# Altium project 2019000808-SPI.PRJPCB
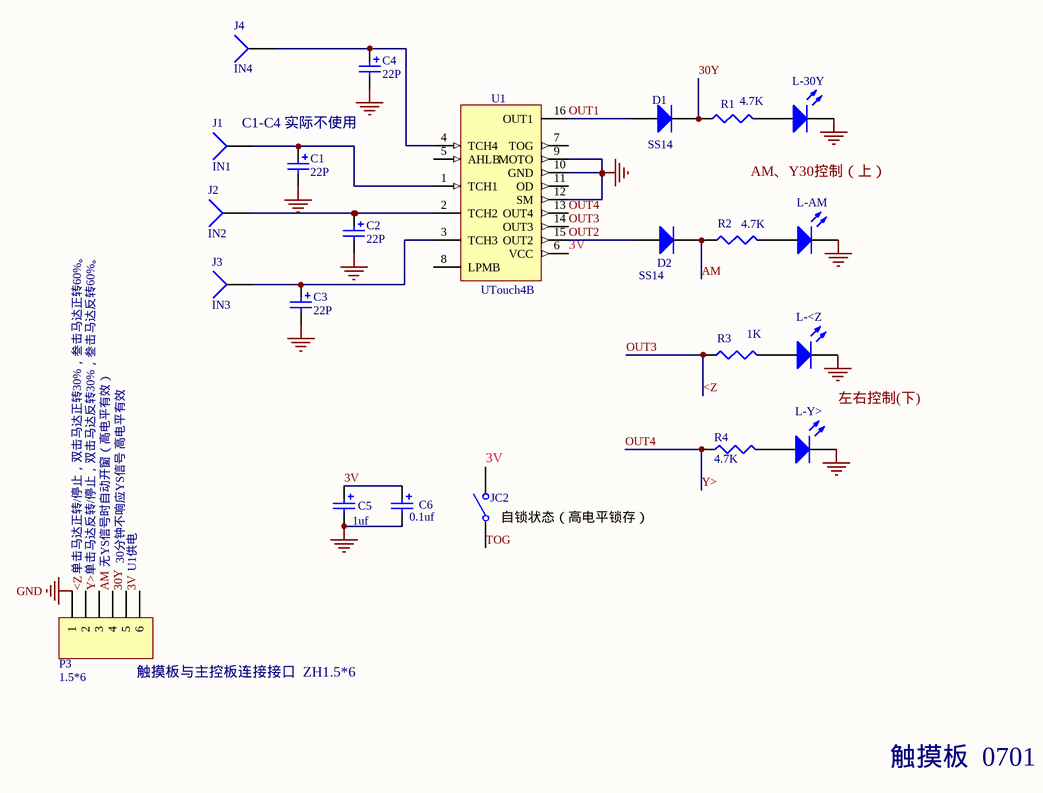
[diagram p0: SPI-4B触摸.SCHDOC]
6 sheets, 226 parts. Net scope: global (net labels, ports and power ports of the same name join across sheets).
Board files: SPI-4B触摸.PCBDOC, SPI-遥控.PCBDOC, SPI-主板-开关.PcbDoc, SPI-光电.PCBDOC, SPI-无线无线充.PcbDoc, SPI-无WIFF3P6I.PCBDOC
Sheets:
  SPI-4B触摸.SCHDOC
  SPI-遥控.SCHDOC
  SPI-主板-开关.SCHDOC
  SPI-光电.SCHDOC
  SPI-无线无线充.SCHDOC
  SPI-无WIFF3P6.SCHDOC

## Sheet SPI-4B触摸.SCHDOC
size A4; PageSetup: Record=PageOptions|CenterHorizontal=True|CenterVertical=True|PrintScale=0.96|XCorrection=1.00|YCorrection=1.00|PrintKind=2|BorderSize=5000000|LeftOffset=0|BottomOffset=0|Orientation=2|PaperLength=1000|PaperWidth=1000|Scale=100|PaperSource=7|PrintQuality=-4|MediaType=1|DitherType=10|PaperKind=A4|PrintScaleMode=1

### Parts
(Parts that share a designator on the sheet are numbered #1, #2 ... from top to bottom, then left to right.)
C1#1  value 22P  [CC2012-0805]
C2#1  value 22P  [CC2012-0805]
C3#1  value 22P  [CC2012-0805]
C4#1  value 22P  [CC2012-0805]
C5#1  1uf  [CC2012-0805]
C6#1  0.1uf  [CC2012-0805]
D1#1  SS14  [DIO7.1-3.9x1.9]
D2  SS14  [DIO7.1-3.9x1.9]
J1  IN1  [PIN1]
J2  IN2  [PIN1]
J3  IN3  [PIN1]
J4  IN4  [PIN1]
JC2  自锁状态（高电平锁存）  [SPST-2]
L-30Y  (no value)  [SMD _LED]
L-<Z  (no value)  [SMD _LED]
L-AM  (no value)  [SMD _LED]
L-Y>  (no value)  [SMD _LED]
P3  1.5*6  [MHDR1X6]
R1#1  4.7K  [C1608-0603]
R2#1  4.7K  [C1608-0603]
R3#1  value 1K  [C1608-0603]
R4#1  4.7K  [C1608-0603]
U1#1  UTouch4B  [TSSO5x6-G16]

### Nets
GND: C1#1.2 C2#1.2 C3#1.2 C4#1.2 C5#1.2 C6#1.2 L-30Y.2(K) L-<Z.2(K) L-AM.2(K) L-Y>.2(K) P3.1 U1#1.9(MOTO) U1#1.10(GND) U1#1.12(SM)
3V: C5#1.1 C6#1.1 JC2.2(NO) P3.6 U1#1.6(VCC)
30Y: D1#1.2(K) P3.5 R1#1.1
<Z: P3.2 R3#1.1 U1#1.14(OUT3)  [also labelled OUT3]
AM: D2.2(K) P3.4 R2#1.1
OUT1: D1#1.1(A) U1#1.16(OUT1)
OUT2: D2.1(A) U1#1.15(OUT2)
OUT4: P3.3 R4#1.1 U1#1.13(OUT4)  [also labelled Y>]
TOG: JC2.2(COMMON)
NetC1#1_1: C1#1.1 J1.1 U1#1.1(TCH1)
NetC2#1_1: C2#1.1 J2.1 U1#1.2(TCH2)
NetC3#1_1: C3#1.1 J3.1 U1#1.3(TCH3)
NetC4#1_1: C4#1.1 J4.1 U1#1.4(TCH4)
NetL-30Y_1: L-30Y.1(A) R1#1.2
NetL-<Z_1: L-<Z.1(A) R3#1.2
NetL-AM_1: L-AM.1(A) R2#1.2
NetL-Y>_1: L-Y>.1(A) R4#1.2

Not connected (* = marked no-connect by the designer): U1#1 5(AHLB) 7(TOG) 8(LPMB) 11(OD)

### Notes on the sheet
- C1-C4 实际不使用
- (near P3) 无YS信号时自动开窗（高电平有效）
- 30分钟不响应YS信号 高电平有效
- (near P3) U1供电
- (near P3) 单击马达正转/停止，双击马达正转30%，叁击马达正转60%。
- (near P3) 单击马达反转/停止，双击马达反转30%，叁击马达反转60%。
- (near P3) 触摸板与主控板连接接口  ZH1.5*6
- 触摸板  0701
- Labels drawn without touching a wire or pin: AM、Y30控制（上）, 左右控制(下)

### Library data of the parts
C1#1 C2#1 C3#1 C4#1 C5#1 C6#1 = Cap Pol3: Polarized Capacitor (Surface Mount); Published: 8-Jun-2000; LatestRevisionDate: 17-Jul-2002; LatestRevisionNote: Re-released for DXP Platform.; Publisher: Altium Limited; PackageReference: C0805
D1#1 D2 = Diode 1N914: High Conductance Fast Diode; Published: 8-Jun-2000; LatestRevisionDate: 17-Jul-2002; LatestRevisionNote: Re-released for DXP Platform.; Publisher: Altium Limited; PackageReference: DO-35; DatasheetDocument: 1997; Code_JEDEC: DO-204-AH
J1-J4 = Socket: LatestRevisionDate: 17-Jul-2002; LatestRevisionNote: Re-released for DXP Platform.; Publisher: Altium Limited
JC2 = SW-SPST: Single-Pole, Single-Throw Switch; Published: 24-Mar-1999; LatestRevisionDate: 17-Jul-2002; LatestRevisionNote: Re-released for DXP Platform.; Publisher: Altium Limited
L-30Y L-<Z L-AM L-Y> = LED3: Typical BLUE SiC LED; Published: 8-Jun-2000; LatestRevisionDate: 17-Dec-2003; LatestRevisionNote: PCB Footprint replaced.; Publisher: Altium Limited
P3 = MHDR1X6: Header, 6-Pin; LatestRevisionDate: 17-Jul-2002; LatestRevisionNote: Re-released for DXP Platform.; Publisher: Altium Limited
R1#1 R2#1 R3#1 R4#1 = Res3: Resistor; Published: 8-Jun-2000; LatestRevisionDate: 17-Jul-2002; LatestRevisionNote: Re-released for DXP Platform.; Publisher: Altium Limited
U1#1 = ADC-8: Generic 8-Bit A/D Converter; Published: 8-Jun-2000; LatestRevisionDate: 17-Jul-2002; LatestRevisionNote: Re-released for DXP Platform.; Publisher: Altium Limited; Code_JEDEC: MO-153-AB

## Sheet SPI-遥控.SCHDOC
size B; SheetNumber: 0; SheetTotal: 0; PageSetup: Record=PageOptions|CenterHorizontal=True|CenterVertical=True|PrintScale=0.73|XCorrection=1.00|YCorrection=1.00|PrintKind=2|BorderSize=5000000|LeftOffset=0|BottomOffset=0|Orientation=2|PaperLength=1000|PaperWidth=1000|Scale=100|PaperSource=1|PrintQuality=300|MediaType=1|DitherType=10|PaperKind=A4|PrintScaleMode=1
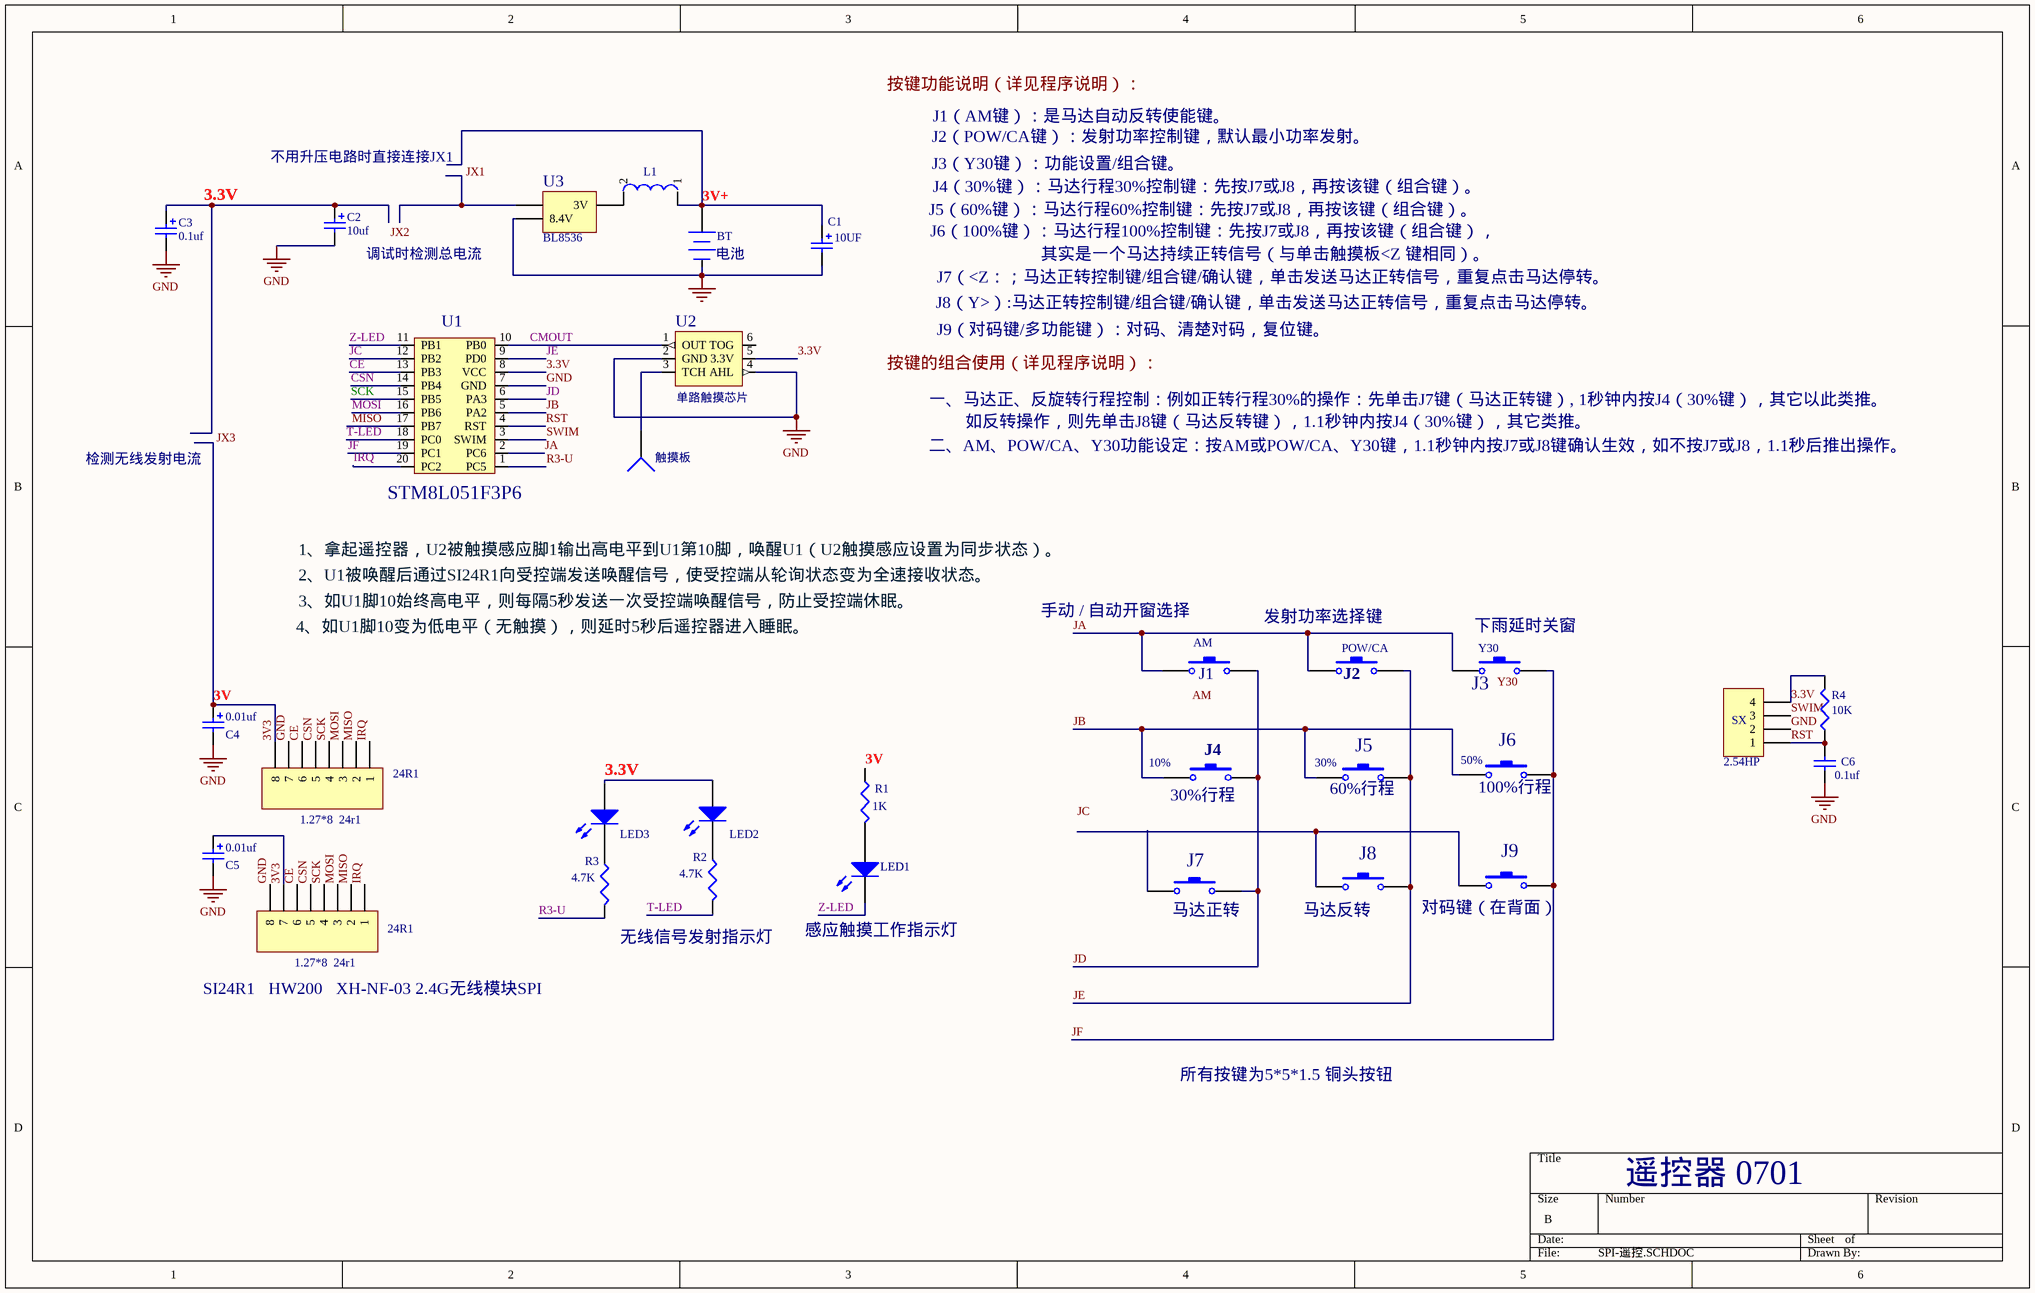
[diagram p1: SPI-遥控.SCHDOC]

### Parts
(Parts that share a designator on the sheet are numbered #1, #2 ... from top to bottom, then left to right.)
10%  J4  [SPST-2]
24R1#1  1.27*8  24r1  [HDR1X8]
24R1#2  1.27*8  24r1  [HDR1X8]
30%  J5  [SPST-2]
50%  J6  [SPST-2]
?#1  触摸板  [PIN1]
AM  J1  [SPST-2]
BT#1  3V  [BAT-2]  (value not drawn)
C1#2  10UF  [CC2012-0805]
C2#2  10uf  [CC2012-0805]
C3#2  0.1uf  [CC2012-0805]
C4#2  0.01uf  [CC2012-0805]
C5#2  0.01uf  [CC2012-0805]
C6#2  value 0.1uf  [CC1608-0603]  (hidden comment: Cap Semi)
L1#1  (no value)  [L7]
LED1  LED  [LED-1]
LED2  LED  [LED-1]  (value not drawn)
LED3  LED  [LED-1]  (value not drawn)
POW/CA  J2  [SPST-2]
R1#2  value 1K  [C1608-0603]
R2#2  value 4.7K  [C1608-0603]
R3#2  value 4.7K  [C1608-0603]
R4#2  value 10K  [C1608-0603]
SX#1  2.54HP  [HDR1X4]
U1#2  STM8L051F3P6  [TSSOP20]
U2#1  单路触摸芯片  [2308]
U3#1  BL8536  [MHDR2X2]
Y30  J3  [SPST-2]
对码键（在背面）  J9  [SPST-2]
马达反转  J8  [SPST-2]
马达正转  J7  [SPST-2]

### Nets
GND: 24R1#1.7 24R1#2.8 C1#2.2 C2#2.2 C3#2.2 C4#2.2 C5#2.2 C6#2.1 SX#1.2 U1#2.7(GND) U2#1.2(GND) U2#1.4(AHL) U3#1.3.3_IN(8.4V)
3.3V: C2#2.1 C3#2.1 LED2.1(A) LED3.1(A) R4#2.2 SX#1.4 U1#2.8(VCC) U2#1.5(3.3V)
3V: 24R1#1.6 24R1#1.8 24R1#2.6 24R1#2.7 C4#2.1 C5#2.1 R1#2.1 U1#2.13(PB3)  [also labelled 3V3, CE]
3V+: BT#1.1(+) C1#2.1 L1#1.1
CMOUT: U1#2.10(PB0) U2#1.1(OUT)
CSN: 24R1#1.5 24R1#2.5 U1#2.14(PB4)
IRQ: 24R1#1.1 24R1#2.1 U1#2.20(PC2)
JA: AM.1 POW/CA.1 U1#2.2(PC6) Y30.1
JB: 10%.1 30%.1 50%.1 U1#2.5(PA2)
JC: U1#2.12(PB2)
JD: 10%.2 AM.2 U1#2.6(PA3) 马达正转.2
JE: 30%.2 POW/CA.2 U1#2.9(PD0) 马达反转.2
JF: 50%.2 U1#2.19(PC1) Y30.2 对码键（在背面）.2
MISO: 24R1#1.2 24R1#2.2 U1#2.17(PB7)
MOSI: 24R1#1.3 24R1#2.3 U1#2.16(PB6)
R3-U: R3#2.2 U1#2.1(PC5)
RST: C6#2.2 R4#2.1 SX#1.1 U1#2.4(RST)  [project net NRSET]
SCK: 24R1#1.4 24R1#2.4 U1#2.15(PB5)
SWIM: SX#1.3 U1#2.3(SWIM)
T-LED: R2#2.2 U1#2.18(PC0)
Z-LED: LED1.2(K) U1#2.11(PB1)
Net?#1_1: ?#1.1 U2#1.3(TCH)
NetL1#1_2: L1#1.2 U3#1.2(3V)
NetLED1_1: LED1.1(A) R1#2.2
NetLED3_2: LED3.2(K) R3#2.1
Net对码键（在背面）_1: 对码键（在背面）.1 马达反转.1

Not connected (* = marked no-connect by the designer): BT#1 2(-); LED2 2(K); R2#2 1; U2#1 6(TOG); U3#1 3.3OUT; 马达正转 1

### Notes on the sheet
- 按键功能说明（详见程序说明）：
- (near C2#2) 不用升压电路时直接连接JX1
- J2（POW/CA键）：发射功率控制键，默认最小功率发射。
- J1（AM键）：是马达自动反转使能键。
- J5（60%键）：马达行程60%控制键：先按J7或J8，再按该键（组合键）。
- J6（100%键）：马达行程100%控制键：先按J7或J8，再按该键（组合键），
- J3（Y30键）：功能设置/组合键。
- J4（30%键）：马达行程30%控制键：先按J7或J8，再按该键（组合键）。
- (near C2#2) 调试时检测总电流
- (near BT#1) 电池
- J7（<Z：；马达正转控制键/组合键/确认键，单击发送马达正转信号，重复点击马达停转。
- 其实是一个马达持续正转信号（与单击触摸板<Z 键相同）。
- 按键的组合使用（详见程序说明）：
- J8（Y>）:马达正转控制键/组合键/确认键，单击发送马达正转信号，重复点击马达停转。
- J9（对码键/多功能键）：对码、清楚对码，复位键。
- 一、马达正、反旋转行程控制：例如正转行程30%的操作：先单击J7键（马达正转键）, 1秒钟内按J4（30%键），其它以此类推。
- 如反转操作，则先单击J8键（马达反转键），1.1秒钟内按J4（30%键），其它类推。
- 检测无线发射电流
- 二、AM、POW/CA、Y30功能设定：按AM或POW/CA、Y30键，1.1秒钟内按J7或J8键确认生效，如不按J7或J8，1.1秒后推出操作。
- 1、拿起遥控器，U2被触摸感应脚1输出高电平到U1第10脚，唤醒U1（U2触摸感应设置为同步状态）。
- 4、如U1脚10变为低电平（无触摸），则延时5秒后遥控器进入睡眠。
- 2、U1被唤醒后通过SI24R1向受控端发送唤醒信号，使受控端从轮询状态变为全速接收状态。
- 3、如U1脚10始终高电平，则每隔5秒发送一次受控端唤醒信号，防止受控端休眠。
- 手动 / 自动开窗选择
- 发射功率选择键
- (near Y30) 下雨延时关窗
- (near 10%) 30%行程
- (near 30%) 60%行程
- (near 50%) 100%行程
- 无线信号发射指示灯
- (near LED1) 感应触摸工作指示灯
- SI24R1   HW200   XH-NF-03 2.4G无线模块SPI
- 所有按键为5*5*1.5 铜头按钮
- 遥控器 0701
- Labels drawn without touching a wire or pin: AM, JC, JX1, JX2, JX3, Y30

### Library data of the parts
10% 30% 50% AM POW/CA Y30 对码键（在背面） 马达反转 马达正转 = SW-PB: Switch; Published: 24-Mar-1999; LatestRevisionDate: 17-Jul-2002; LatestRevisionNote: Re-released for DXP Platform.; Publisher: Altium Limited
24R1#1 24R1#2 = Header 8: Header, 8-Pin; LatestRevisionDate: 17-Jul-2002; LatestRevisionNote: Re-released for DXP Platform.; Publisher: Altium Limited
?#1 = Socket: LatestRevisionDate: 17-Jul-2002; LatestRevisionNote: Re-released for DXP Platform.; Publisher: Altium Limited
BT#1 = Battery: Multicell Battery; Published: 24-Mar-1999; LatestRevisionDate: 17-Jul-2002; LatestRevisionNote: Re-released for DXP Platform.; Publisher: Altium Limited
C1#2 C2#2 C3#2 C4#2 C5#2 = Cap Pol3: Polarized Capacitor (Surface Mount); Published: 8-Jun-2000; LatestRevisionDate: 17-Jul-2002; LatestRevisionNote: Re-released for DXP Platform.; Publisher: Altium Limited; PackageReference: C0805
C6#2 = Cap Semi: Capacitor (Semiconductor SIM Model); Published: 8-Jun-2000; LatestRevisionDate: 17-Jul-2002; LatestRevisionNote: Re-released for DXP Platform.; PackageReference: C1206; Publisher: Altium Limited
L1#1 = L
LED1-LED3 = LED1: Typical RED GaAs LED; Published: 8-Jun-2000; LatestRevisionDate: 17-Jul-2002; LatestRevisionNote: Re-released for DXP Platform.; Publisher: Altium Limited
R1#2 R2#2 R3#2 R4#2 = Res3: Resistor; Published: 8-Jun-2000; LatestRevisionDate: 17-Jul-2002; LatestRevisionNote: Re-released for DXP Platform.; Publisher: Altium Limited
SX#1 = Header 4: Header, 4-Pin; LatestRevisionDate: 17-Jul-2002; LatestRevisionNote: Re-released for DXP Platform.; Publisher: Altium Limited
U1#2 = STM8L051
U2#1 = 1308
U3#1 = MHDR2X2: Header, 2-Pin, Dual row; LatestRevisionDate: 17-Jul-2002; LatestRevisionNote: Re-released for DXP Platform.; Publisher: Altium Limited

## Sheet SPI-主板-开关.SCHDOC
size A4; PageSetup: Record=PageOptions|CenterHorizontal=True|CenterVertical=True|PrintScale=0.96|XCorrection=1.00|YCorrection=1.00|PrintKind=2|BorderSize=5000000|LeftOffset=0|BottomOffset=0|Orientation=2|PaperLength=1000|PaperWidth=1000|Scale=100|PaperSource=7|PrintQuality=-4|MediaType=1|DitherType=10|PaperKind=A4|PrintScaleMode=1
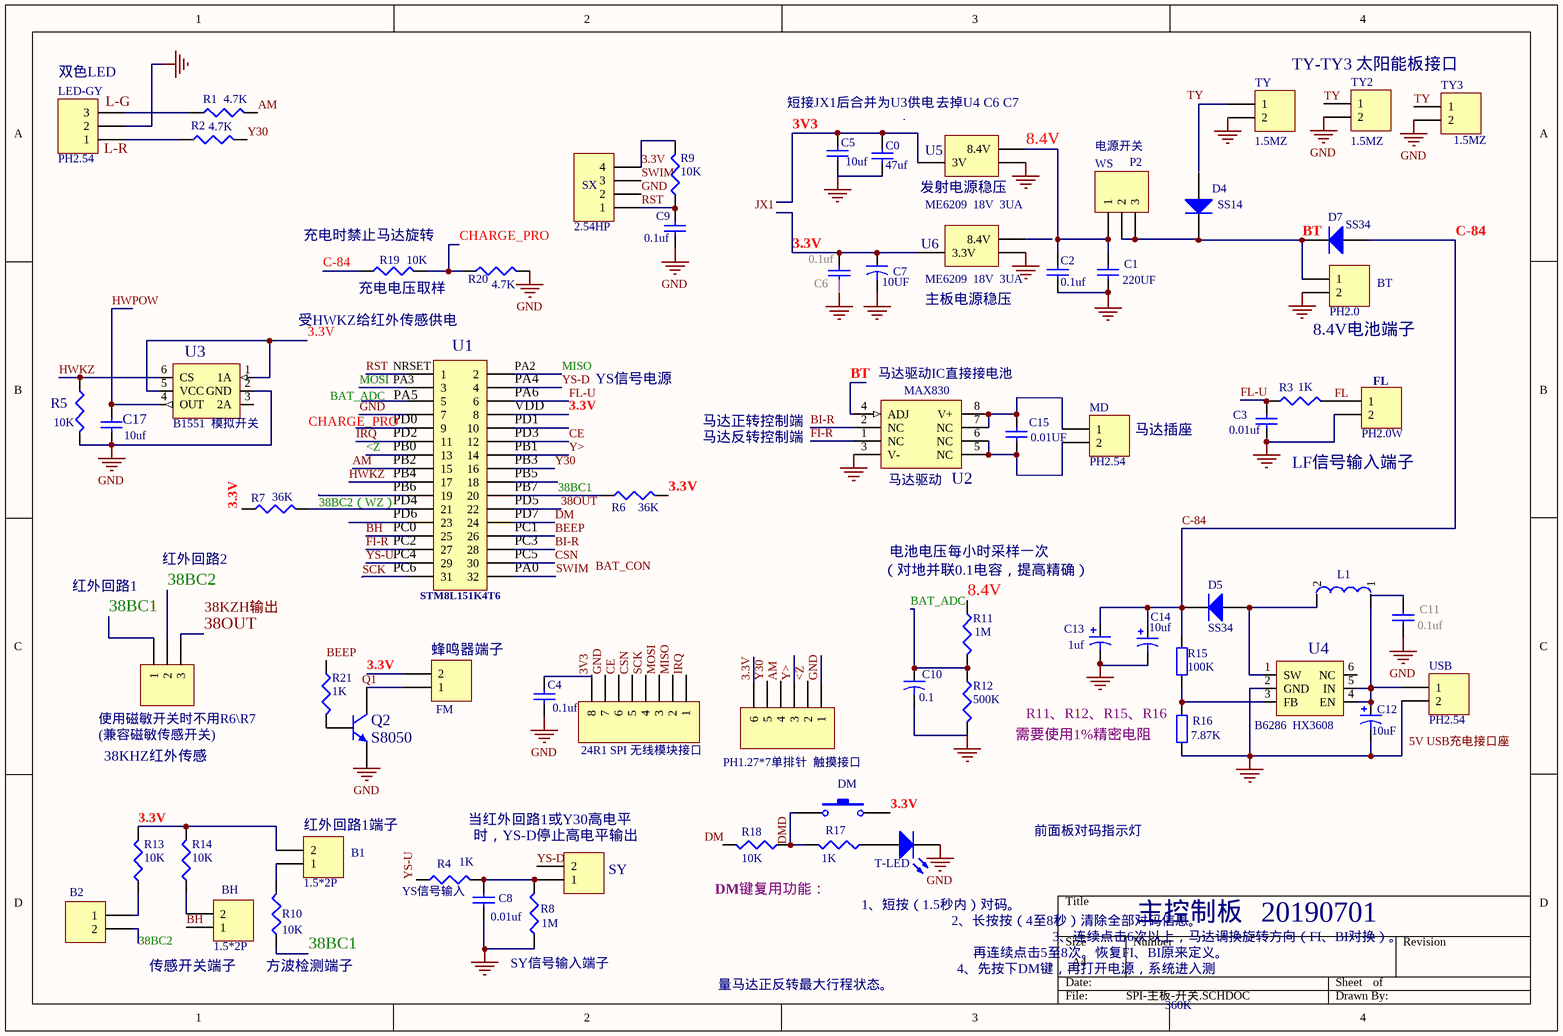
[diagram p2: SPI-主板-开关.SCHDOC]

### Parts
(Parts that share a designator on the sheet are numbered #1, #2 ... from top to bottom, then left to right.)
24R1_SPI_无线模块接口#1  Header 8  [HDR1X8]  (value not drawn)
(兼容磁敏传感开关)  PH2.0  [HDR1X3]  (value not drawn)
B1  1.5*2P  [HDR1X2]
B2  1.5*2P  [HDR1X2]  (value not drawn)
BH  1.5*2P  [HDR1X2]
BT#2  PH2.0  [HDR1X2]
C0  value 47uf  [CC1608-0603]
C1#3  value 220UF  [CC3216-1206]  (hidden comment: Cap Semi)
C2#3  value 0.1uf  [CC1608-0603]  (hidden comment: Cap Semi)
C3#3  0.01uf  [CC1608-0603]
C4#3  value 0.1uf  [CC1608-0603]
C5#3  10uf  [CC1608-0603]
C6#3  value 0.1uf  [CC1608-0603]  (hidden comment: 10UF)
C7#1  10UF  [CAPPR2-5x6.8]
C8#1  0.01uf  [CC1608-0603]
C9#1  value 0.1uf  [CC1608-0603]  (hidden comment: Cap Semi)
C10#1  value 0.1  [CAPPR2-5x6.8]  (hidden comment: 10UF)
C11#1  value 0.1uf  [CC3216-1206]  (hidden comment: Cap Semi)
C12  value 10uF  [C0805]  (hidden comment: Cap Pol1)
C13  value 1uf  [CC3216-1206]
C14  value 10uf  [CC3216-1206]
C15  0.01UF  [CC1608-0603]
C17  10uf  [CC1608-0603]
D4  SS14  [DIO7.1-3.9x1.9]
D5  SS34  [D0805]
D7  SS34  [D0805]
DM#1  (no value)  [SPST-2]
FL#1  PH2.0W  [HDR1X2]
FM  (no value)  [HDR1X2]
L1#2  (no value)  [L7]
LED-GY  PH2.54  [HDR1X3]
MD  PH2.54  [HDR1X2]
PH1.27*7单排针_触摸接口  Header 6  [HDR1X6]  (value not drawn)
Q2#1  S8050  [BCY-W3/E4]
R1#3  value 4.7K  [C1608-0603]
R2#3  value 4.7K  [C1608-0603]
R3#3  value 1K  [C1608-0603]
R4#3  value 1K  [C1608-0603]
R5#1  value 10K  [C1608-0603]
R6#1  value 36K  [C1608-0603]
R7#1  value 36K  [C1608-0603]
R8#1  value 1M  [C1608-0603]
R9#1  value 10K  [C1608-0603]
R10  value 10K  [C1608-0603]
R11#1  1M  value 360K  [C1608-0603]
R12  value 500K  [C1608-0603]
R13  value 10K  [C1608-0603]
R14  value 10K  [C1608-0603]
R15  value 100K  [C0805]  (hidden comment: Res2)
R16  value 7.87K  [C0805]  (hidden comment: Res2)
R17  value 1K  [C1608-0603]
R18  value 10K  [C1608-0603]
R19  10K  [C1608-0603]
R20  4.7K  [C1608-0603]
R21  value 1K  [C1608-0603]
SX#2  2.54HP  [HDR1X4]
SY#1  PH2.0WJ  [HDR1X2]  (value not drawn)
T-LED  (no value)  [LED-1]
TY2  1.5MZ  [HDR1X2]
TY3  1.5MZ  [HDR1X2]
TY#1  1.5MZ  [HDR1X2]
U1#3  STM8L151K4T6  [HDR2X16]
U2#2  马达驱动  Publisher: MAX830  [SO8]
U3#2  B1551  模拟开关  [2308]
U4  B6286  HX3608  [2308]
U5  ME6209  18V  3UA  [MHDR2X2]
U6  ME6209  18V  3UA  [MHDR2X2]
USB#1  PH2.54  [HDR1X2]
WS  P2  [HDR1X3]

### Nets
GND: 24R1_SPI_无线模块接口#1.7 BT#2.2 C0.1 C1#3.2 C2#3.1 C3#3.1 C4#3.1 C6#3.1 C7#1.2 C8#1.1 C9#1.1 C10#1.2 C11#1.2 C12.2 C13.2 C14.2 C17.1 FL#1.2 LED-GY.2 PH1.27*7单排针_触摸接口.1 R5#1.1 R8#1.1 R12.1 R16.2 R20.2 SX#2.2 T-LED.2(K) TY2.2 TY3.2 TY#1.2 U1#3.7 U2#2.3(V-) U3#2.2(GND) U4.2(GND) U5.3.3OUT U6.3.3OUT USB#1.2
3.3V: B1.2 C6#3.2 C7#1.1 DM#1.2 FM.2 PH1.27*7单排针_触摸接口.6 R6#1.2 R7#1.1 R9#1.2 R13.2 R14.2 SX#2.4 U1#3.8 U3#2.1(1A) U3#2.5(VCC) U6.2(3.3V)
3V3: 24R1_SPI_无线模块接口#1.6 24R1_SPI_无线模块接口#1.8 C0.2 C4#3.2 C5#3.2 U1#3.12 U5.2(3V)  [also labelled CE]  [project net 3V]
8.4V: C1#3.1 C2#3.2 R11#1.2 U5.3.3_IN(8.4V) WS.1
38BC1: (兼容磁敏传感开关).1 R6#1.1 R10.1 U1#3.20
38BC2: (兼容磁敏传感开关).2
38OUT: (兼容磁敏传感开关).3 U1#3.22  [project net 1Q-B]
<Z: PH1.27*7单排针_触摸接口.2 U1#3.13
AM: PH1.27*7单排针_触摸接口.4 R1#3.2 U1#3.15
BAT_ADC: C10#1.1 R11#1.1 R12.2
BEEP: R21.1 U1#3.26
BH: BH.1 U1#3.25
BI-R: U1#3.28 U2#2.2(NC)
BT: BT#2.1 D4.2(K) D7.2(K) U2#2.4(ADJ) WS.2 WS.3
C-84: C13.1 C14.1 D5.2(K) D7.1(A) R15.1 R19.1
CHARGE_PRO: R19.2 R20.1
CSN: 24R1_SPI_无线模块接口#1.5 U1#3.30
DM: U1#3.24
DMD: DM#1.1 R17.1 R18.2
FI-R: U1#3.27 U2#2.1(NC)
FL: FL#1.1 R3#3.2
FL-U: C3#3.2 R3#3.1 U1#3.6
HWKZ: R5#1.2 U1#3.17 U3#2.6(CS)
HWPOW: C17.2 U3#2.4(OUT)
IRQ: 24R1_SPI_无线模块接口#1.1 U1#3.11
MISO: 24R1_SPI_无线模块接口#1.2 U1#3.2  [also labelled PA2]
MOSI: 24R1_SPI_无线模块接口#1.3 U1#3.3  [also labelled PA3]
NRSET: C9#1.2 R9#1.1 SX#2.1 U1#3.1  [also labelled RST]
SCK: 24R1_SPI_无线模块接口#1.4 U1#3.31
SWIM: SX#2.3 U1#3.32
TY: TY2.1 TY3.1
Y30: PH1.27*7单排针_触摸接口.5 R2#3.2 U1#3.16
Y>: PH1.27*7单排针_触摸接口.3 U1#3.14  [project net OUT4]
YS-D: SY#1.2 U1#3.4
YS-U: R4#3.1 U1#3.29
NetB1_1: B1.1 R10.2
NetB2_1: B2.1 R13.1
NetBH_2: BH.2 R14.1
NetC8#1_2: C8#1.2 R4#3.2 R8#1.2 SY#1.1
NetC12_1: C12.1 L1#2.1 U4.4(EN) U4.5(IN) USB#1.1
NetC15_1: C15.1 MD.2 U2#2.5(NC) U2#2.6(NC)
NetC15_2: C15.2 MD.1 U2#2.7(NC) U2#2.8(V+)
NetD5_1: D5.1(A) L1#2.2 U4.1(SW)
NetFM_1: FM.1 Q2#1.3(C)
NetLED-GY_1: LED-GY.1 R2#3.1
NetLED-GY_3: LED-GY.3 R1#3.1
NetQ2#1_2: Q2#1.2(B) R21.2
NetR7#1_2: R7#1.2 U1#3.21
NetR15_2: R15.2 R16.1 U4.3(FB)
NetR17_2: R17.2 T-LED.1(A)

Not connected (* = marked no-connect by the designer): B2 2; C5#3 1; C11#1 1; D4 1(A); Q2#1 1(E); R18 1; TY#1 1; U1#3 5 9 10 18 19 23; U3#2 3(2A); U4 6(NC); U6 3.3 IN(8.4V)

### Notes on the sheet
- (near LED-GY) 双色LED
- 短接JX1后合并为U3供电
- (near U5) 去掉U4 C6 C7
- TY-TY3 太阳能板接口
- 电源开关
- (near R19) 充电时禁止马达旋转
- (near U5) 发射电源稳压
- (near R19) 充电电压取样
- 主板电源稳压
- (near U3#2) 受HWKZ给红外传感供电
- (near U1#3) PA4
- YS信号电源
- (near U2#2) 马达驱动IC直接接电池
- (near BT#2) 8.4V电池端子
- (near U1#3) PD0
- (near U1#3) PD2
- (near U1#3) PB0
- (near U1#3) PA5
- (near U1#3) PA6
- (near U1#3) PD1
- (near U1#3) PD3
- (near U1#3) PB1
- (near U1#3) VDD
- 马达正转控制端
- 马达反转控制端
- (near MD) 马达插座
- (near U1#3) PD4
- (near U1#3) PD6
- (near U1#3) PB2
- (near U1#3) PB4
- (near U1#3) PB6
- (near U1#3) PD5
- (near U1#3) PD7
- (near U1#3) PB3
- (near U1#3) PB5
- (near U1#3) PB7
- LF信号输入端子
- 红外回路2
- (near U1#3) PC0
- (near U1#3) PC2
- (near U1#3) PC4
- (near U1#3) PC6
- (near U1#3) PA0
- (near U1#3) PC1
- (near U1#3) PC3
- (near U1#3) PC5
- (near R11#1) （对地并联0.1电容，提高精确）
- (near R11#1) 电池电压每小时采样一次
- 红外回路1
- (near FM) 蜂鸣器端子
- R11、R12、R15、R16
- (near (兼容磁敏传感开关)) 使用磁敏开关时不用R6\R7
- 38KHZ红外传感
- (near R12) 需要使用1%精密电阻
- (near B1) 红外回路1端子
- 当红外回路1或Y30高电平
- 时，YS-D停止高电平输出
- 前面板对码指示灯
- (near R4#3) YS信号输入
- DM键复用功能：
- 1、短按（1.5秒内）对码。
- 主控制板
- 20190701
- (near B2) 传感开关端子
- 方波检测端子
- (near R8#1) SY信号输入端子
- 量马达正反转最大行程状态。
- 2、长按按（4至8秒）清除全部对码信息。
- 4、先按下DM键，再打开电源，系统进入测
- 再连续点击5至8次。恢复FI、BI原来定义。
- 3、连续点击6次以上，马达调换旋转方向（FI、BI对换）。
- Labels drawn without touching a wire or pin: 5V USB充电接口座, 38BC2, 38BC2（WZ）, 38KZH输出, BAT_ADC, BAT_CON, CHARGE_PRO, DM, GND, JX1, L-G, L-R, Q1, TY

### Library data of the parts
24R1_SPI_无线模块接口#1 = Header 8: Header, 8-Pin; LatestRevisionDate: 17-Jul-2002; LatestRevisionNote: Re-released for DXP Platform.; Publisher: Altium Limited
(兼容磁敏传感开关) LED-GY WS = Header 3: Header, 3-Pin; LatestRevisionDate: 17-Jul-2002; LatestRevisionNote: Re-released for DXP Platform.; Publisher: Altium Limited
B1 B2 BH BT#2 FL#1 FM MD SY#1 TY2 TY3 TY#1 USB#1 = Header 2: Header, 2-Pin; LatestRevisionDate: 17-Jul-2002; LatestRevisionNote: Re-released for DXP Platform.; Publisher: Altium Limited
C0 C1#3 C2#3 C3#3 C4#3 C5#3 C6#3 C9#1 C11#1 C15 C17 = Cap Semi: Capacitor (Semiconductor SIM Model); Published: 8-Jun-2000; LatestRevisionDate: 17-Jul-2002; LatestRevisionNote: Re-released for DXP Platform.; PackageReference: C1206; Publisher: Altium Limited
  C5#3: Value: 10uf
  C15: Value: 0.01UF
C7#1 C10#1 = Cap2: Capacitor; Published: 23-Sep-2002; Publisher: Altium Limited
  C7#1: Value: 10UF
C8#1 = Cap Semi: Capacitor (Semiconductor SIM Model); Value: 100pF; Published: 8-Jun-2000; LatestRevisionDate: 17-Jul-2002; LatestRevisionNote: Re-released for DXP Platform.; PackageReference: C1206; Publisher: Altium Limited
C12-C14 = Cap Pol1: Polarized Capacitor (Radial); Published: 8-Jun-2000; LatestRevisionDate: 17-Jul-2002; LatestRevisionNote: Re-released for DXP Platform.; PackageReference: RB7.6-15; Publisher: Altium Limited; PackageDescription: Polarized Capacitor (Radial); 2 Leads
D4 = Diode 1N914: High Conductance Fast Diode; Published: 8-Jun-2000; LatestRevisionDate: 17-Jul-2002; LatestRevisionNote: Re-released for DXP Platform.; Publisher: Altium Limited; PackageReference: DO-35; DatasheetDocument: 1997; Code_JEDEC: DO-204-AH
D5 D7 = Diode: Default Diode; Published: 8-Jun-2000; LatestRevisionDate: 17-Jul-2002; LatestRevisionNote: Re-released for DXP Platform.; PackageVersion: Sep-1996; PackageReference: SMC; Publisher: SS24; PackageDescription: DO-214-AB/SMC; 2 C-Bend Leads; Body 7.9 x 5.9 mm, inc. leads (LxW); Code_JEDEC: DO-214-AB
DM#1 = SW-PB: Switch; Published: 24-Mar-1999; LatestRevisionDate: 17-Jul-2002; LatestRevisionNote: Re-released for DXP Platform.; Publisher: Altium Limited
L1#2 = L
PH1.27*7单排针_触摸接口 = Header 6: Header, 6-Pin; LatestRevisionDate: 17-Jul-2002; LatestRevisionNote: Re-released for DXP Platform.; Publisher: Altium Limited
Q2#1 = 2N3904: NPN General Purpose Amplifier; Published: 8-Jun-2000; LatestRevisionDate: 15-Jan-2003; LatestRevisionNote: PCB Footprint 'BCY-W3/D4.7' replaced; DatasheetDocument: 1997; PackageReference: TO-92A; Publisher: Altium Limited; Code_JEDEC: TO-92A
R1#3 R2#3 R3#3 R4#3 R5#1 R6#1 R7#1 R8#1 R9#1 R10 R11#1 R12-R14 R17-R21 = Res3: Resistor; Published: 8-Jun-2000; LatestRevisionDate: 17-Jul-2002; LatestRevisionNote: Re-released for DXP Platform.; Publisher: Altium Limited
R15 R16 = Res2: Resistor; Published: 8-Jun-2000; LatestRevisionDate: 17-Jul-2002; LatestRevisionNote: Re-released for DXP Platform.; PackageReference: AXIAL-0.4; Publisher: Altium Limited; PackageDescription: Axial Device, Thru-Hole; 2 Leads; 0.4 in Pin Spacing
SX#2 = Header 4: Header, 4-Pin; LatestRevisionDate: 17-Jul-2002; LatestRevisionNote: Re-released for DXP Platform.; Publisher: Altium Limited
T-LED = LED1: Typical RED GaAs LED; Published: 8-Jun-2000; LatestRevisionDate: 17-Jul-2002; LatestRevisionNote: Re-released for DXP Platform.; Publisher: Altium Limited
U1#3 = Header 16X2: Header, 16-Pin, Dual row; LatestRevisionDate: 17-Jul-2002; LatestRevisionNote: Re-released for DXP Platform.; Publisher: Altium Limited
U2#2 = LM135D: Precision Temperature Sensor; Published: 24-Aug-2001; LatestRevisionDate: 17-Jul-2002; LatestRevisionNote: Re-released for DXP Platform.; DatasheetDocument: Oct-1997; PackageDocument: Jul-1998; PackageReference: SO8; Code_JEDEC: MS-012-AA; Code_IPC: SO8
U3#2 = 1308
U4 = 1308: 1308A: u4
U5 U6 = MHDR2X2: Header, 2-Pin, Dual row; LatestRevisionDate: 17-Jul-2002; LatestRevisionNote: Re-released for DXP Platform.; Publisher: Altium Limited

## Sheet SPI-光电.SCHDOC
size A4
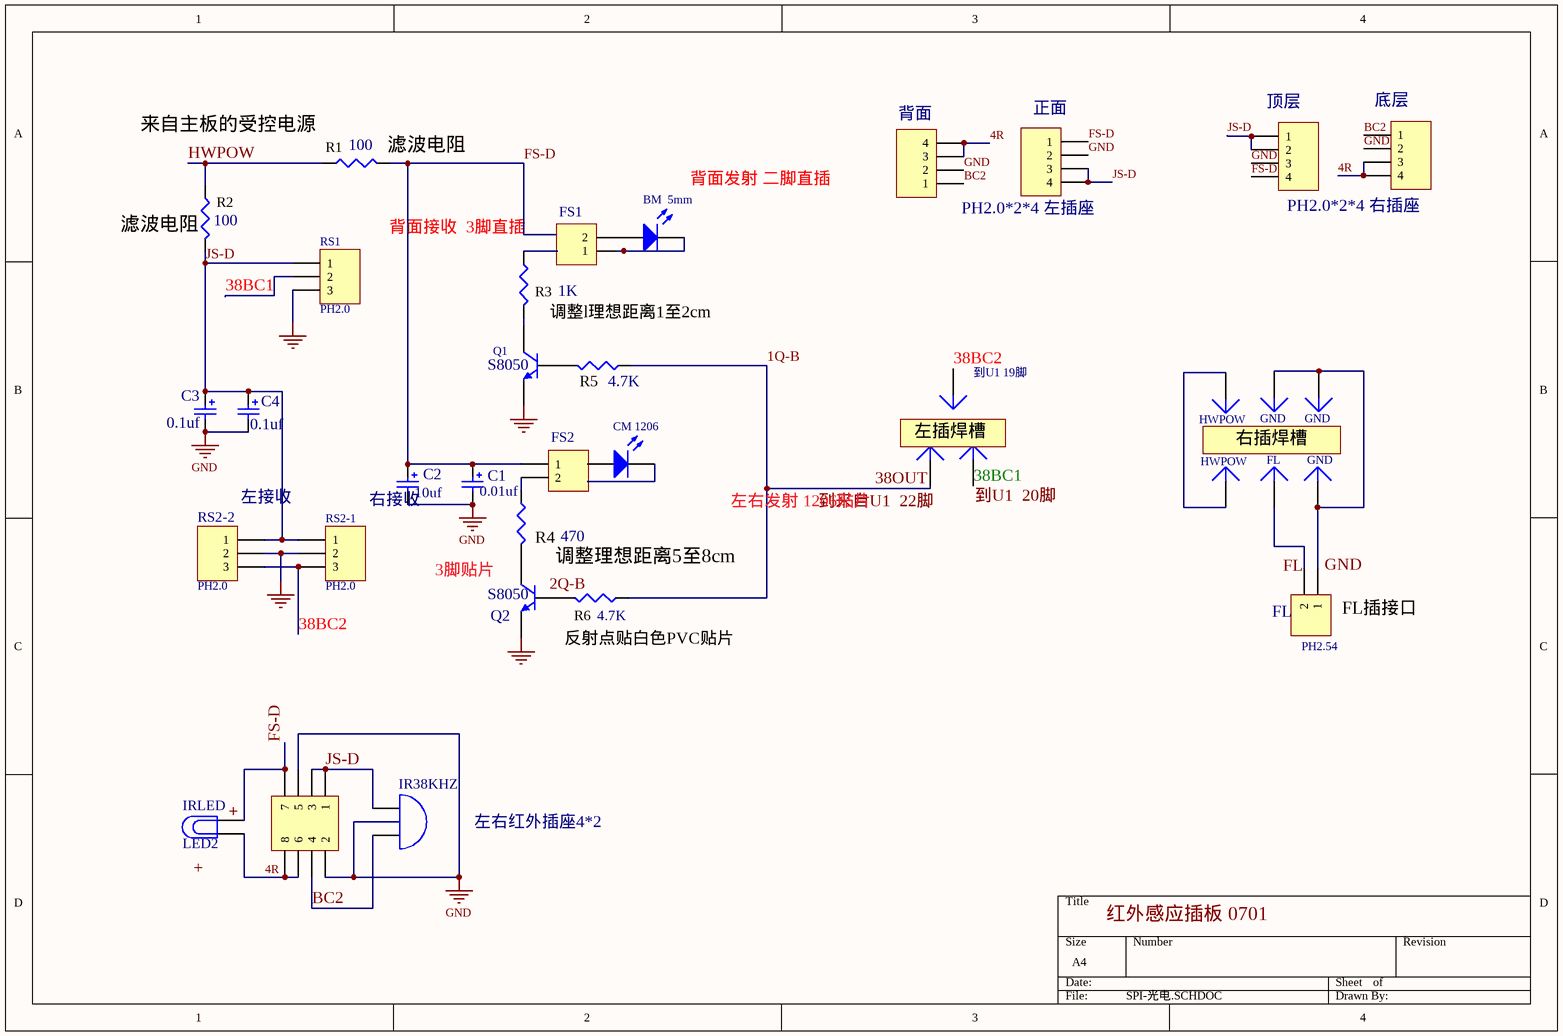
[diagram p3: SPI-光电.SCHDOC]

### Parts
(Parts that share a designator on the sheet are numbered #1, #2 ... from top to bottom, then left to right.)
38BC1  (no value)  [PIN1]
38OUT  (no value)  [PIN1]
?#2  GND  [PIN1]
BM_5mm  (no value)  [LED-1]
C1#4  0.01uf  [CC2012-0805]
C2#4  value 10uf  [CC2012-0805]
C3#4  value 0.1uf  [CC2012-0805]
C4#4  value 0.1uf  [CC2012-0805]
CM_1206  (no value)  [LED-1]
FL#2  (no value)  [PIN1]
FL#3  PH2.54  [HDR1X2]
FS1  PH2.0  [HDR1X2]  (value not drawn)
FS2  PH2.0  [HDR1X2]  (value not drawn)
GND#1  (no value)  [PIN1]
GND#2  (no value)  [PIN1]
HWPOW#1  (no value)  [PIN1]
HWPOW#2  (no value)  [PIN1]
IR38KHZ  (no value)  [PIN2]
IRLED  LED2  [PIN2]
Q1  S8050  [BCY-W3/E4]
Q2#2  S8050  [BCY-W3/E4]
R1#4  100  [C1608-0603]
R2#4  100  [C1608-0603]
R3#4  1K  [C1608-0603]
R4#4  value 470  [C1608-0603]
R5#2  value 4.7K  [C1608-0603]
R6#2  value 4.7K  [C1608-0603]
RS1  PH2.0  [HDR1X3]
RS2-1  PH2.0  [HDR1X3]
RS2-2  PH2.0  [HDR1X3]
到U1_19脚  (no value)  [PIN1]
左右红外插座4*2  PH2.0*2*4  [HDR2X4H]  (value not drawn)
底层  PH2.0*2*4  [HDR1X4]  (value not drawn)
正面  PH2.0*2*4 左插座  [HDR1X4]
背面  PH2.0*2*4  [HDR1X4]  (value not drawn)
顶层  PH2.0*2*4 右插座  [HDR1X4]

### Nets
GND: C1#4.2 C2#4.2 C3#4.2 C4#4.2 Q1.1(E) Q2#2.1(E) RS1.3 RS2-1.2 RS2-2.2 左右红外插座4*2.2 左右红外插座4*2.5 底层.2 正面.2 背面.2 顶层.3
1Q-B: 38OUT.1 R5#2.2 R6#2.2  [also labelled 38OUT]
4R: IRLED.1 左右红外插座4*2.6 左右红外插座4*2.8 底层.3 底层.4 背面.3 背面.4
38BC1: 38BC1.1 RS1.2
38BC2: RS2-1.3 RS2-2.3 到U1_19脚.1
BC2: IR38KHZ.2(B) 左右红外插座4*2.4 底层.1 背面.1
FS-D: C1#4.1 C2#4.1 FS2.1 IRLED.2 R1#4.1 左右红外插座4*2.7 正面.1 顶层.4
HWPOW: R1#4.2 R2#4.2
JS-D: C3#4.1 C4#4.1 IR38KHZ.1(A) R2#4.1 RS1.1 RS2-1.1 RS2-2.1 左右红外插座4*2.1 左右红外插座4*2.3 正面.3 正面.4 顶层.1 顶层.2
Net?#2_1: ?#2.1 FL#3.2
NetBM_5mm_2: BM_5mm.2(K) FS1.1
NetFL#2_1: FL#2.1 FL#3.1 GND#1.1 GND#2.1
NetFS2_2: FS2.2 R4#4.2
NetHWPOW#1_1: HWPOW#1.1 HWPOW#2.1
NetQ1_2: Q1.2(B) R5#2.1
NetQ1_3: Q1.3(C) R3#4.1
NetQ2#2_2: Q2#2.2(B) R6#2.1
NetQ2#2_3: Q2#2.3(C) R4#4.1

Not connected (* = marked no-connect by the designer): BM_5mm 1(A); CM_1206 1(A) 2(K); FS1 2; R3#4 2

### Notes on the sheet
- (near RS1) 背面接收  3脚直插
- 背面发射 二脚直插
- (near RS2-2) 左接收
- 右接收
- (near CM_1206) 左右发射 1206贴片
- 3脚贴片
- Labels drawn without touching a wire or pin: 2Q-B, +, FL, FL插接口, GND, 到U1  20脚, 到来自U1  22脚, 反射点贴白色PVC贴片, 右插焊槽, 左插焊槽, 来自主板的受控电源, 滤波电阻, 红外感应插板 0701, 调整l理想距离1至2cm, 调整理想距离5至8cm

### Library data of the parts
38BC1 38OUT ?#2 FL#2 GND#1 GND#2 HWPOW#1 HWPOW#2 到U1_19脚 = Plug: LatestRevisionDate: 17-Jul-2002; LatestRevisionNote: Re-released for DXP Platform.; Publisher: Altium Limited
BM_5mm CM_1206 = LED1: Typical RED GaAs LED; Published: 8-Jun-2000; LatestRevisionDate: 17-Jul-2002; LatestRevisionNote: Re-released for DXP Platform.; Publisher: Altium Limited
C1#4 = Cap Pol3: Polarized Capacitor (Surface Mount); C2: 0.1uf; Published: 8-Jun-2000; LatestRevisionDate: 17-Jul-2002; LatestRevisionNote: Re-released for DXP Platform.; Publisher: Altium Limited; PackageReference: C0805
C2#4 C3#4 C4#4 = Cap Pol3: Polarized Capacitor (Surface Mount); Published: 8-Jun-2000; LatestRevisionDate: 17-Jul-2002; LatestRevisionNote: Re-released for DXP Platform.; Publisher: Altium Limited; PackageReference: C0805
FL#3 FS1 FS2 = Header 2: Header, 2-Pin; LatestRevisionDate: 17-Jul-2002; LatestRevisionNote: Re-released for DXP Platform.; Publisher: Altium Limited
IR38KHZ = Bell: Electrical Bell; Published: 24-Mar-1999; LatestRevisionDate: 17-Jul-2002; LatestRevisionNote: Re-released for DXP Platform.; Publisher: Altium Limited
IRLED = Lamp: Incandescent Bulb; Published: 24-Mar-1999; LatestRevisionDate: 17-Jul-2002; LatestRevisionNote: Re-released for DXP Platform.; Publisher: Altium Limited
Q1 Q2#2 = 2N3904: NPN General Purpose Amplifier; Published: 8-Jun-2000; LatestRevisionDate: 15-Jan-2003; LatestRevisionNote: PCB Footprint 'BCY-W3/D4.7' replaced; DatasheetDocument: 1997; PackageReference: TO-92A; Publisher: Altium Limited; Code_JEDEC: TO-92A
R1#4 R2#4 R3#4 R4#4 R5#2 R6#2 = Res3: Resistor; Published: 8-Jun-2000; LatestRevisionDate: 17-Jul-2002; LatestRevisionNote: Re-released for DXP Platform.
  R1#4 R2#4: 100: 100
  R3#4 R4#4 R5#2 R6#2: Publisher: Altium Limited
RS1 RS2-1 RS2-2 = Header 3: Header, 3-Pin; LatestRevisionDate: 17-Jul-2002; LatestRevisionNote: Re-released for DXP Platform.; Publisher: Altium Limited
左右红外插座4*2 = Header 4X2H: Header, 4-Pin, Dual row, Right Angle; LatestRevisionDate: 17-Jul-2002; LatestRevisionNote: Re-released for DXP Platform.; Publisher: Altium Limited
底层 正面 背面 顶层 = Header 4: Header, 4-Pin; LatestRevisionDate: 17-Jul-2002; LatestRevisionNote: Re-released for DXP Platform.; Publisher: Altium Limited

## Sheet SPI-无线无线充.SCHDOC
size A4; PageSetup: Record=PageOptions|CenterHorizontal=True|CenterVertical=True|PrintScale=0.96|XCorrection=1.00|YCorrection=1.00|PrintKind=2|BorderSize=5000000|LeftOffset=0|BottomOffset=0|Orientation=2|PaperLength=1000|PaperWidth=1000|Scale=100|PaperSource=7|PrintQuality=-4|MediaType=1|DitherType=10|PaperKind=A4|PrintScaleMode=1
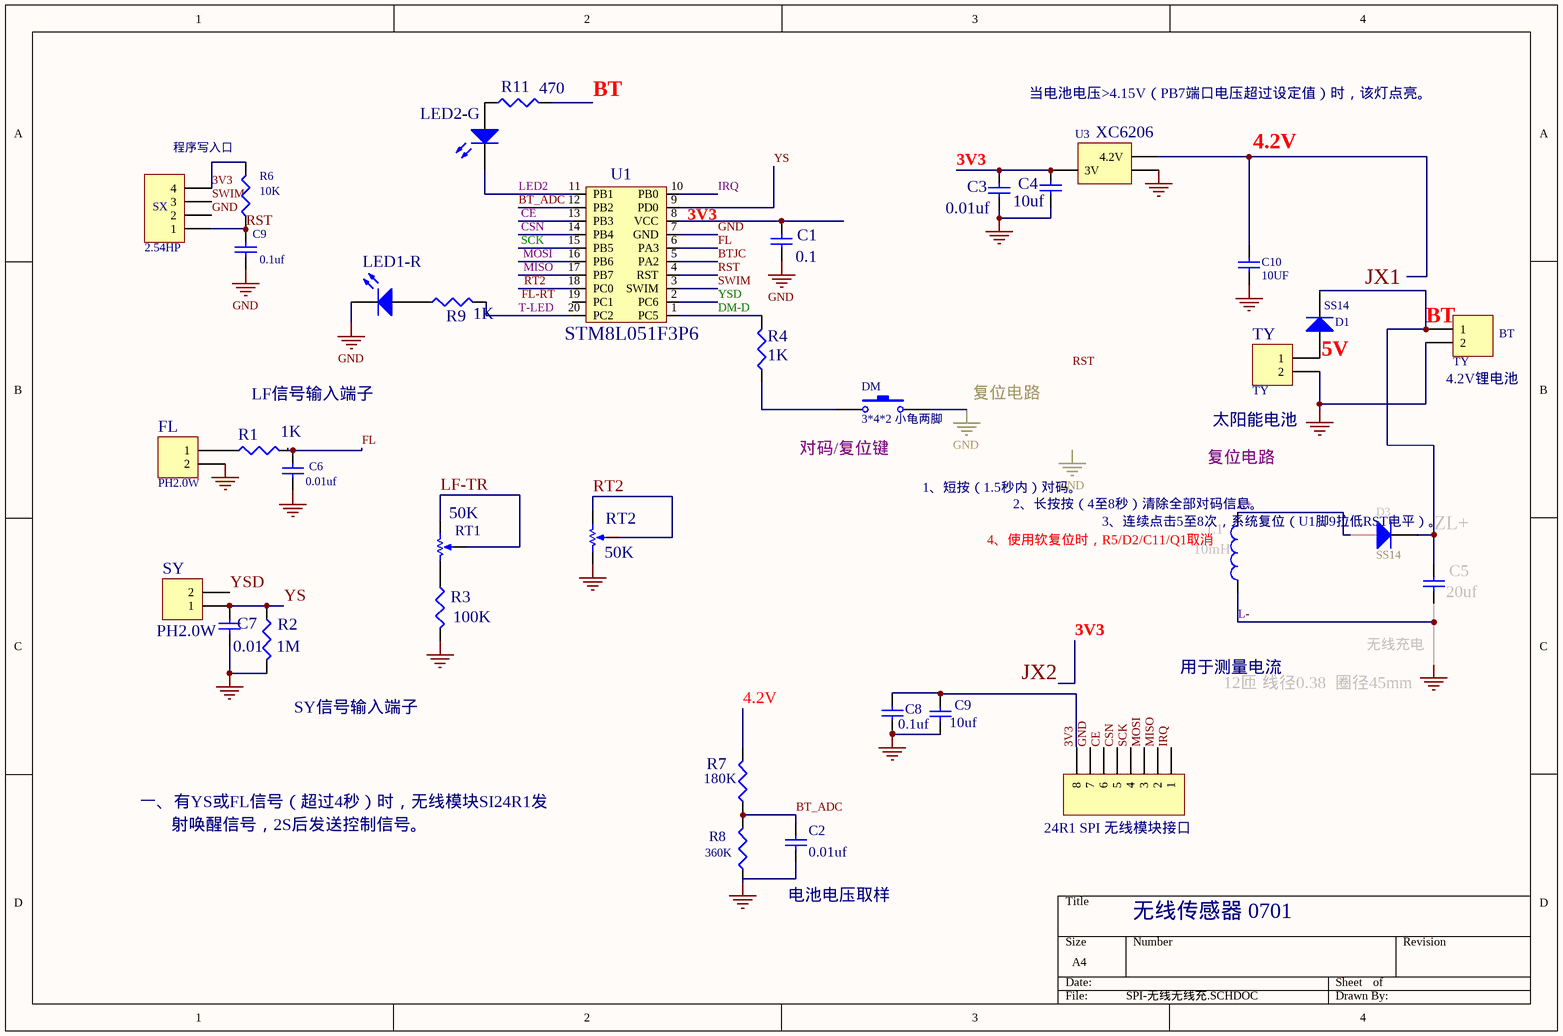
[diagram p4: SPI-无线无线充.SCHDOC]

### Parts
(Parts that share a designator on the sheet are numbered #1, #2 ... from top to bottom, then left to right.)
24R1_SPI_无线模块接口#2  Header 8  [HDR1X8]  (value not drawn)
BT#3  TY  [HDR1X2]
C1#5  value 0.1  [CC1608-0603]
C2#5  0.01uf  [CC1608-0603]
C3#5  value 0.01uf  [CC1608-0603]
C4#5  value 10uf  [CC1608-0603]
C5#4  value 20uf  [CC1608-0603]
C6#4  0.01uf  [CC1608-0603]
C7#2  0.01  [CC1608-0603]
C8#2  0.1uf  [CC1608-0603]
C9#2  value 0.1uf  [CC1608-0603]  (hidden comment: Cap Semi)
C9#3  10uf  [CC1608-0603]
C10#2  value 10UF  [CC1608-0603]
D1#2  SS14  [DIO7.1-3.9x1.9]
D3  SS14  [DIO7.1-3.9x1.9]
DM#2  3*4*2 小龟两脚  [SPST-2]
FL#4  PH2.0W  [HDR1X2]
L1#3  12匝 线径0.38  圈径45mm  value 10mH  [INDC1005-0402]
LED1-R  (no value)  [LED-0]
LED2-G  (no value)  [LED-0]
R1#5  value 1K  [C1608-0603]
R2#5  value 1M  [C1608-0603]
R3#5  value 100K  [C1608-0603]
R4#5  value 1K  [C1608-0603]
R6#3  value 10K  [C1608-0603]
R7#2  value 180K  [C1608-0603]
R8#2  value 360K  [C1608-0603]
R9#2  1K  [C1608-0603]
R11#2  470  [C1608-0603]
RT1  50K  [VR5]
RT2  50K  [VR5]
SX#3  2.54HP  [HDR1X4]
SY#2  PH2.0W  [HDR1X2]
TY#2  TY  [HDR1X2]
U1#4  STM8L051F3P6  [TSSOP20]
U3#3  XC6206  [MHDR2X2]

### Nets
GND: 24R1_SPI_无线模块接口#2.7 BT#3.2 C1#5.1 C2#5.1 C3#5.1 C4#5.2 C5#4.2 C6#4.1 C7#2.1 C8#2.1 C9#2.1 C9#3.1 C10#2.2 DM#2.2 FL#4.2 L1#3.2 LED1-R.2(K) R2#5.1 R3#5.1 R8#2.1 RT2.2(BOT) SX#3.2 TY#2.2 U1#4.7(GND) U3#3.3.3OUT  [also labelled L-]
3V3: 24R1_SPI_无线模块接口#2.6 24R1_SPI_无线模块接口#2.8 C3#5.2 C4#5.1 R6#3.2 SX#3.4 U1#4.13(PB3) U3#3.2(3V)  [also labelled CE]  [project net 3V]
4.2V: R7#2.2
BT: BT#3.1 C5#4.1 D1#2.2(K) D3.2(K) R11#2.2  [also labelled JX1, ZL+]
BT_ADC: C2#5.2 R7#2.1 R8#2.2 U1#4.12(PB2)
BTJC: U1#4.5(PA2)
CSN: 24R1_SPI_无线模块接口#2.5 U1#4.14(PB4)
DM-D: R4#5.2 U1#4.1(PC5)
FL: C6#4.2 R1#5.1 U1#4.6(PA3)
IRQ: 24R1_SPI_无线模块接口#2.1 U1#4.10(PB0)
L+: D3.1(A) L1#3.1
LED2: LED2-G.2(K) U1#4.11(PB1)
LF-TR: RT1.1(TOP) RT1.3(TAP)
MISO: 24R1_SPI_无线模块接口#2.2 U1#4.17(PB7)
MOSI: 24R1_SPI_无线模块接口#2.3 U1#4.16(PB6)
RST: C9#2.2 R6#3.1 SX#3.1 U1#4.4(RST)  [project net NRSET]
RT2: RT2.1(TOP) RT2.3(TAP) U1#4.18(PC0)
SCK: 24R1_SPI_无线模块接口#2.4 U1#4.15(PB5)
SWIM: SX#3.3 U1#4.3(SWIM)
T-LED: R9#2.2 U1#4.20(PC2)
YS: C7#2.2 R2#5.2 SY#2.1 U1#4.9(PD0)
YSD: SY#2.2 U1#4.2(PC6)
NetC1#5_2: C1#5.2 U1#4.8(VCC)
NetC8#2_2: C8#2.2 C9#3.2
NetC10#2_1: C10#2.1 U3#3.3.3_IN(4.2V)
NetD1#2_1: D1#2.1(A) TY#2.1
NetDM#2_1: DM#2.1 R4#5.1
NetFL#4_1: FL#4.1 R1#5.2
NetLED1-R_1: LED1-R.1(A) R9#2.1
NetLED2-G_1: LED2-G.1(A) R11#2.1
NetR3#5_2: R3#5.2 RT1.2(BOT)

Not connected (* = marked no-connect by the designer): U1#4 19(PC1)

### Notes on the sheet
- 当电池电压>4.15V（PB7端口电压超过设定值）时，该灯点亮。
- 程序写入口
- (near BT#3) 4.2V锂电池
- LF信号输入端子
- 太阳能电池
- 1、短按（1.5秒内）对码。
- 2、长按按（4至8秒）清除全部对码信息。
- 4、使用软复位时，R5/D2/C11/Q1取消
- 3、连续点击5至8次，系统复位（U1脚9拉低RST电平）。
- 无线充电
- (near R2#5) SY信号输入端子
- 用于测量电流
- 一、有YS或FL信号（超过4秒）时，无线模块SI24R1发
- 射唤醒信号，2S后发送控制信号。
- 电池电压取样
- 无线传感器 0701
- Labels drawn without touching a wire or pin: 3V3, 4.2V, 5V, FL-RT, GND, JX2, RST, 复位电路, 对码/复位键

### Library data of the parts
24R1_SPI_无线模块接口#2 = Header 8: Header, 8-Pin; LatestRevisionDate: 17-Jul-2002; LatestRevisionNote: Re-released for DXP Platform.; Publisher: Altium Limited
BT#3 FL#4 SY#2 TY#2 = Header 2: Header, 2-Pin; LatestRevisionDate: 17-Jul-2002; LatestRevisionNote: Re-released for DXP Platform.; Publisher: Altium Limited
C1#5 C3#5 C4#5 C5#4 C9#2 C10#2 = Cap Semi: Capacitor (Semiconductor SIM Model); Published: 8-Jun-2000; LatestRevisionDate: 17-Jul-2002; LatestRevisionNote: Re-released for DXP Platform.; PackageReference: C1206; Publisher: Altium Limited
C2#5 C6#4 C7#2 C9#3 = Cap Semi: as C8#1 on sheet SPI-主板-开关; Published: 8-Jun-2000; LatestRevisionDate: 17-Jul-2002; LatestRevisionNote: Re-released for DXP Platform.; PackageReference: C1206; Publisher: Altium Limited
C8#2 = Cap Semi: Capacitor (Semiconductor SIM Model); Value: 10UF; Published: 8-Jun-2000; LatestRevisionDate: 17-Jul-2002; LatestRevisionNote: Re-released for DXP Platform.; PackageReference: C1206; Publisher: Altium Limited
D1#2 D3 = Diode 1N4148: High Conductance Fast Diode; Published: 8-Jun-2000; LatestRevisionDate: 17-Jul-2002; LatestRevisionNote: Re-released for DXP Platform.; Publisher: Altium Limited; Code_JEDEC: DO-204-AH; DatasheetDocument: 1997; PackageReference: DO-35
DM#2 = SW-PB: Switch; Published: 24-Mar-1999; LatestRevisionDate: 17-Jul-2002; LatestRevisionNote: Re-released for DXP Platform.; Publisher: Altium Limited
L1#3 = Inductor: Code_IEC: 1005; Published: 8-Jun-2000; LatestRevisionDate: 17-Jul-2002; LatestRevisionNote: Re-released for DXP Platform.; PackageReference: 0402-A; Publisher: Altium Limited; Code_JEITA: 0402
LED1-R LED2-G = LED0: Typical INFRARED GaAs LED; Published: 8-Jun-2000; LatestRevisionDate: 17-Jul-2002; LatestRevisionNote: Re-released for DXP Platform.; Publisher: Altium Limited
R1#5 R2#5 R3#5 R4#5 R6#3 R7#2 R8#2 R9#2 R11#2 = Res3: Resistor; Published: 8-Jun-2000; LatestRevisionDate: 17-Jul-2002; LatestRevisionNote: Re-released for DXP Platform.; Publisher: Altium Limited
RT1 RT2 = RPot: Potentiometer; Sim Note: Enter the Resistance value and the set point into parameter fields.; Set Position: 0.5; Published: 8-Jun-2000; LatestRevisionDate: 17-Jul-2002; LatestRevisionNote: Re-released for DXP Platform.; Publisher: Altium Limited
SX#3 = Header 4: Header, 4-Pin; LatestRevisionDate: 17-Jul-2002; LatestRevisionNote: Re-released for DXP Platform.; Publisher: Altium Limited
U1#4 = STM8L051
U3#3 = MHDR2X2: Header, 2-Pin, Dual row; LatestRevisionDate: 17-Jul-2002; LatestRevisionNote: Re-released for DXP Platform.; Publisher: Altium Limited

## Sheet SPI-无WIFF3P6.SCHDOC
size A4; PageSetup: Record=PageOptions|CenterHorizontal=True|CenterVertical=True|PrintScale=0.96|XCorrection=1.00|YCorrection=1.00|PrintKind=0|BorderSize=5000000|LeftOffset=0|BottomOffset=0|Orientation=2|PaperLength=1000|PaperWidth=1000|Scale=100|PaperSource=1|PrintQuality=300|MediaType=1|DitherType=10|PaperKind=A4|PrintScaleMode=1
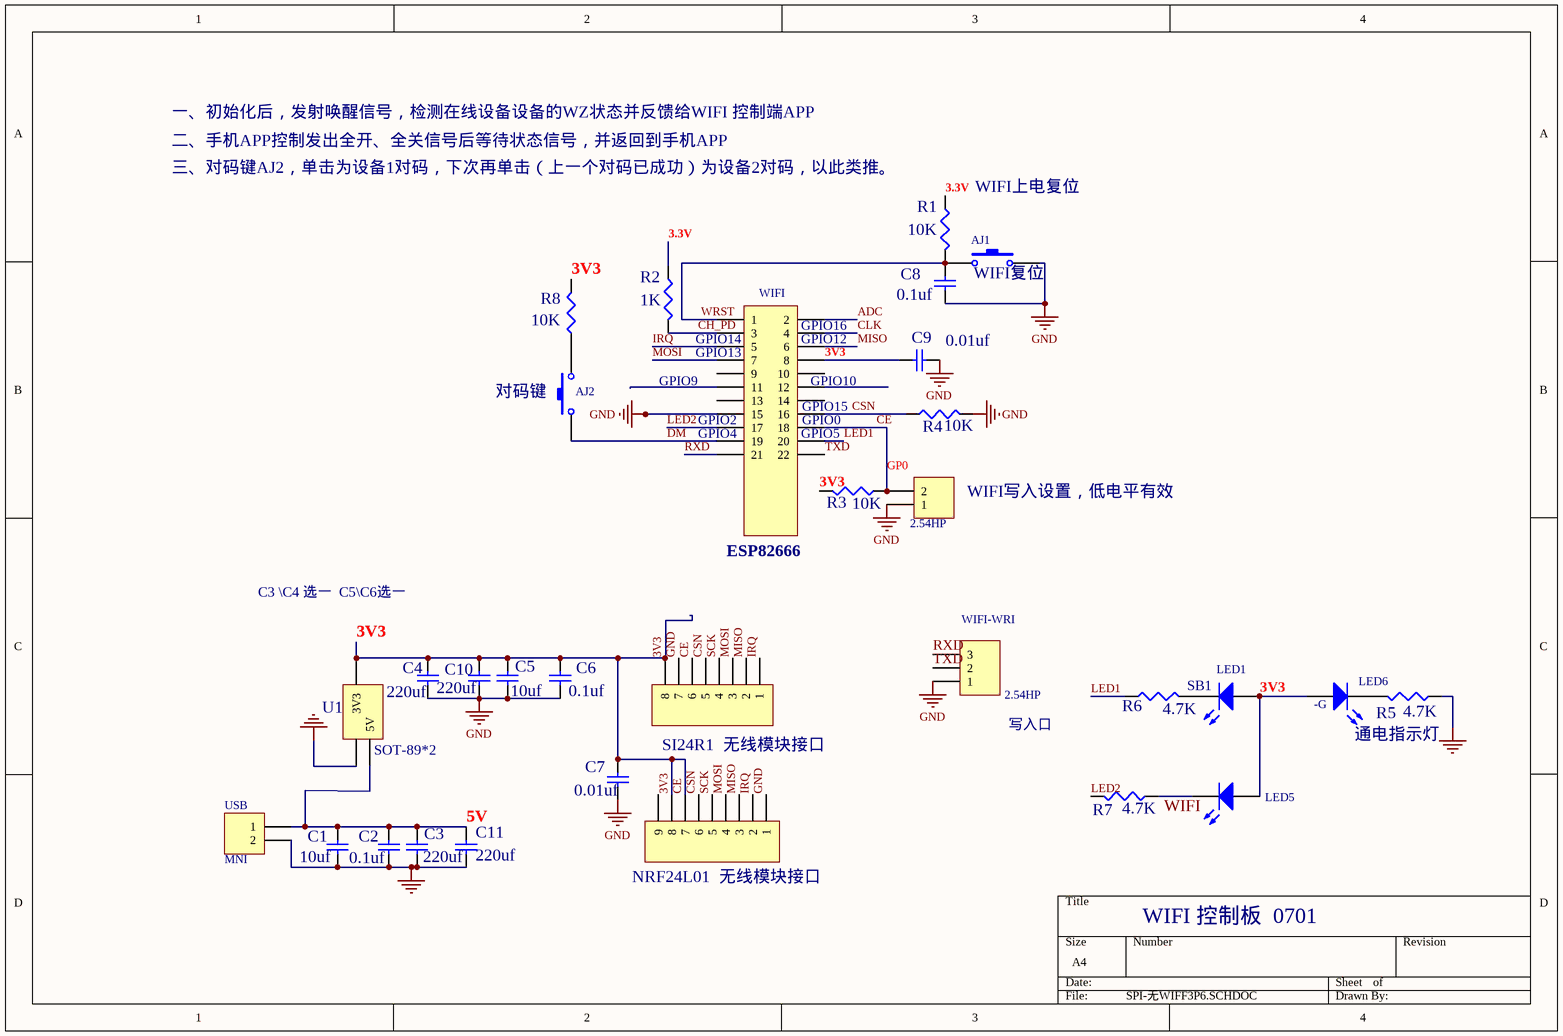
[diagram p5: SPI-无WIFF3P6.SCHDOC]

### Parts
(Parts that share a designator on the sheet are numbered #1, #2 ... from top to bottom, then left to right.)
?#3  LED5  [SMD _LED]
AJ1  WIFI复位  [SPST-2]
AJ2  XHDM1-4  [SPST-2]  (value not drawn)
C1#6  value 10uf  [CC1608-0603]
C2#6  value 0.1uf  [CC1608-0603]
C3#6  value 220uf  [CC1608-0603]
C4#6  value 220uf  [CC1608-0603]
C5#5  value 10uf  [CC1608-0603]
C6#5  value 0.1uf  [CC1608-0603]
C7#3  value 0.01uf  [CC1608-0603]
C8#3  value 0.1uf  [CC1608-0603]
C9#4  value 0.01uf  [CC1608-0603]
C10#3  value 220uf  [CC1608-0603]
C11#2  value 220uf  [CC1608-0603]
LED6  -G  [SMD _LED]
NRF24L01_无线模块接口  Header 9  [HDR1X9]  (value not drawn)
R1#6  value 10K  [C1608-0603]
R2#6  value 1K  [C1608-0603]
R3#6  value 10K  [C1608-0603]
R4#6  value 10K  [C1608-0603]
R5#3  value 4.7K  [C1608-0603]
R6#4  Publisher: 4.7K  [C1608-0603]
R7#3  Publisher: 4.7K  [C1608-0603]
R8#3  Publisher: 10K  [C1608-0603]
SB1  LED1  [SMD _LED]
SI24R1_无线模块接口  Header 8  [HDR1X8]  (value not drawn)
U1#5  AMS1117-3.3  [MHDR2X2]  (value not drawn)
USB#2  MNI  [HDR1X2]
WIFI  ESP82666  [HDR2X16]
WIFI-WRI  2.54HP  [HDR1X3]
WIFI写入设置，低电平有效  2.54HP  [HDR1X2]

### Nets
GND: AJ1.2 C1#6.1 C2#6.2 C3#6.2 C4#6.1 C5#5.2 C6#5.2 C7#3.2 C8#3.2 C9#4.2 C10#3.2 C11#2.2 NRF24L01_无线模块接口.1 R4#6.2 R5#3.1 SI24R1_无线模块接口.7 U1#5.3.3OUT USB#2.2 WIFI.15 WIFI-WRI.1 WIFI写入设置，低电平有效.1
3.3V: R1#6.1 R2#6.1
3V3: ?#3.1(A) C4#6.2 C5#5.1 C6#5.1 C7#3.1 C9#4.1 C10#3.1 LED6.1(A) NRF24L01_无线模块接口.7 NRF24L01_无线模块接口.8 R3#6.1 R3#6.2 R8#3.1 SB1.1(A) SI24R1_无线模块接口.6 SI24R1_无线模块接口.8 U1#5.2(3V3) WIFI.8 WIFI.18 WIFI写入设置，低电平有效.2  [also labelled CE, GP0]  [project net 3V]
5V: C1#6.2 C2#6.1 C3#6.1 C11#2.1 U1#5.3.3_IN(5V) USB#2.1
ADC: WIFI.2
CH_PD: R2#6.2 WIFI.3
CLK: WIFI.4
CSN: NRF24L01_无线模块接口.6 R4#6.1 SI24R1_无线模块接口.5 WIFI.16
DM: AJ2.2 WIFI.19
IRQ: NRF24L01_无线模块接口.2 SI24R1_无线模块接口.1 WIFI.5
LED1: R6#4.2 WIFI.20
LED2: R7#3.1 WIFI.17
MISO: NRF24L01_无线模块接口.3 SI24R1_无线模块接口.2 WIFI.6
MOSI: NRF24L01_无线模块接口.4 SI24R1_无线模块接口.3 WIFI.7
RXD: WIFI.21 WIFI-WRI.3
SCK: NRF24L01_无线模块接口.5 SI24R1_无线模块接口.4
TXD: WIFI.22 WIFI-WRI.2
WRST: AJ1.1 C8#3.1 R1#6.2 WIFI.1
Net?#3_2: ?#3.2(K) R7#3.2
NetAJ2_1: AJ2.1 R8#3.2
NetLED6_2: LED6.2(K) R5#3.2
NetR6#4_1: R6#4.1 SB1.2(K)

Not connected (* = marked no-connect by the designer): NRF24L01_无线模块接口 9; WIFI 9 10 11 12 13 14 23 24 25 26 27 28 29 30 31 32

### Notes on the sheet
- 一、初始化后，发射唤醒信号，检测在线设备设备的WZ状态并反馈给WIFI 控制端APP
- 二、手机APP控制发出全开、全关信号后等待状态信号，并返回到手机APP
- 三、对码键AJ2，单击为设备1对码，下次再单击（上一个对码已成功）为设备2对码，以此类推。
- (near R1#6) WIFI上电复位
- GPIO9
- (near WIFI) GPIO14
- (near WIFI) GPIO13
- (near WIFI) GPIO16
- (near WIFI) GPIO12
- (near WIFI) GPIO10
- 对码键
- (near WIFI) GPIO2
- (near WIFI) GPIO4
- (near WIFI) GPIO5
- (near WIFI) GPIO15
- (near WIFI) GPIO0
- C3 \C4 选一  C5\C6选一
- (near U1#5) SOT-89*2
- (near WIFI-WRI) 写入口
- 通电指示灯
- WIFI 控制板  0701
- Labels drawn without touching a wire or pin: WIFI

### Library data of the parts
?#3 LED6 SB1 = LED3: Typical BLUE SiC LED; Published: 8-Jun-2000; LatestRevisionDate: 17-Dec-2003; LatestRevisionNote: PCB Footprint replaced.; Publisher: Altium Limited
AJ1 AJ2 = SW-PB: Switch; Published: 24-Mar-1999; LatestRevisionDate: 17-Jul-2002; LatestRevisionNote: Re-released for DXP Platform.; Publisher: Altium Limited
C1#6 C2#6 C3#6 C4#6 C5#5 C6#5 C7#3 C8#3 C9#4 C10#3 C11#2 = Cap Semi: Capacitor (Semiconductor SIM Model); Published: 8-Jun-2000; LatestRevisionDate: 17-Jul-2002; LatestRevisionNote: Re-released for DXP Platform.; PackageReference: C1206; Publisher: Altium Limited
NRF24L01_无线模块接口 = Header 9: Header, 9-Pin; LatestRevisionDate: 17-Jul-2002; LatestRevisionNote: Re-released for DXP Platform.; Publisher: Altium Limited
R1#6 R2#6 R3#6 R4#6 R5#3 R6#4 R7#3 R8#3 = Res3: Resistor; Published: 8-Jun-2000; LatestRevisionDate: 17-Jul-2002; LatestRevisionNote: Re-released for DXP Platform.
  R1#6 R2#6 R3#6 R4#6 R5#3: Publisher: Altium Limited
SI24R1_无线模块接口 = Header 8: Header, 8-Pin; LatestRevisionDate: 17-Jul-2002; LatestRevisionNote: Re-released for DXP Platform.; Publisher: Altium Limited
U1#5 = MHDR2X2: Header, 2-Pin, Dual row; LatestRevisionDate: 17-Jul-2002; LatestRevisionNote: Re-released for DXP Platform.; Publisher: Altium Limited
USB#2 WIFI写入设置，低电平有效 = Header 2: Header, 2-Pin; LatestRevisionDate: 17-Jul-2002; LatestRevisionNote: Re-released for DXP Platform.; Publisher: Altium Limited
WIFI = Header 16X2: Header, 16-Pin, Dual row; LatestRevisionDate: 17-Jul-2002; LatestRevisionNote: Re-released for DXP Platform.; Publisher: Altium Limited
WIFI-WRI = Header 3: Header, 3-Pin; LatestRevisionDate: 17-Jul-2002; LatestRevisionNote: Re-released for DXP Platform.; Publisher: Altium Limited

## Nets that join several sheets
GND: SPI-4B触摸 (14 pins), SPI-遥控 (13 pins), SPI-主板-开关 (37 pins), SPI-光电 (15 pins), SPI-无线无线充 (25 pins), SPI-无WIFF3P6 (21 pins)
1Q-B: SPI-主板-开关 ((兼容磁敏传感开关).3 U1#3.22), SPI-光电 (38OUT.1 R5#2.2 R6#2.2)
3.3V: SPI-遥控 (8 pins), SPI-主板-开关 (16 pins), SPI-无WIFF3P6 (R1#6.1 R2#6.1)
3V: SPI-4B触摸 (5 pins), SPI-遥控 (8 pins), SPI-主板-开关 (7 pins), SPI-无线无线充 (8 pins), SPI-无WIFF3P6 (20 pins)
38BC1: SPI-主板-开关 ((兼容磁敏传感开关).1 R6#1.1 R10.1 U1#3.20), SPI-光电 (38BC1.1 RS1.2)
38BC2: SPI-主板-开关 ((兼容磁敏传感开关).2), SPI-光电 (RS2-1.3 RS2-2.3 到U1_19脚.1)
<Z: SPI-4B触摸 (P3.2 R3#1.1 U1#1.14), SPI-主板-开关 (PH1.27*7单排针_触摸接口.2 U1#3.13)
AM: SPI-4B触摸 (D2.2 P3.4 R2#1.1), SPI-主板-开关 (PH1.27*7单排针_触摸接口.4 R1#3.2 U1#3.15)
BT: SPI-主板-开关 (6 pins), SPI-无线无线充 (5 pins)
CSN: SPI-遥控 (24R1#1.5 24R1#2.5 U1#2.14), SPI-主板-开关 (24R1_SPI_无线模块接口#1.5 U1#3.30), SPI-无线无线充 (24R1_SPI_无线模块接口#2.5 U1#4.14), SPI-无WIFF3P6 (NRF24L01_无线模块接口.6 R4#6.1 SI24R1_无线模块接口.5 WIFI.16)
DM: SPI-主板-开关 (U1#3.24), SPI-无WIFF3P6 (AJ2.2 WIFI.19)
FL: SPI-主板-开关 (FL#1.1 R3#3.2), SPI-无线无线充 (C6#4.2 R1#5.1 U1#4.6)
HWPOW: SPI-主板-开关 (C17.2 U3#2.4), SPI-光电 (R1#4.2 R2#4.2)
IRQ: SPI-遥控 (24R1#1.1 24R1#2.1 U1#2.20), SPI-主板-开关 (24R1_SPI_无线模块接口#1.1 U1#3.11), SPI-无线无线充 (24R1_SPI_无线模块接口#2.1 U1#4.10), SPI-无WIFF3P6 (NRF24L01_无线模块接口.2 SI24R1_无线模块接口.1 WIFI.5)
LED2: SPI-无线无线充 (LED2-G.2 U1#4.11), SPI-无WIFF3P6 (R7#3.1 WIFI.17)
MISO: SPI-遥控 (24R1#1.2 24R1#2.2 U1#2.17), SPI-主板-开关 (24R1_SPI_无线模块接口#1.2 U1#3.2), SPI-无线无线充 (24R1_SPI_无线模块接口#2.2 U1#4.17), SPI-无WIFF3P6 (NRF24L01_无线模块接口.3 SI24R1_无线模块接口.2 WIFI.6)
MOSI: SPI-遥控 (24R1#1.3 24R1#2.3 U1#2.16), SPI-主板-开关 (24R1_SPI_无线模块接口#1.3 U1#3.3), SPI-无线无线充 (24R1_SPI_无线模块接口#2.3 U1#4.16), SPI-无WIFF3P6 (NRF24L01_无线模块接口.4 SI24R1_无线模块接口.3 WIFI.7)
NRSET: SPI-遥控 (C6#2.2 R4#2.1 SX#1.1 U1#2.4), SPI-主板-开关 (C9#1.2 R9#1.1 SX#2.1 U1#3.1), SPI-无线无线充 (C9#2.2 R6#3.1 SX#3.1 U1#4.4)
OUT4: SPI-4B触摸 (P3.3 R4#1.1 U1#1.13), SPI-主板-开关 (PH1.27*7单排针_触摸接口.3 U1#3.14)
SCK: SPI-遥控 (24R1#1.4 24R1#2.4 U1#2.15), SPI-主板-开关 (24R1_SPI_无线模块接口#1.4 U1#3.31), SPI-无线无线充 (24R1_SPI_无线模块接口#2.4 U1#4.15), SPI-无WIFF3P6 (NRF24L01_无线模块接口.5 SI24R1_无线模块接口.4)
SWIM: SPI-遥控 (SX#1.3 U1#2.3), SPI-主板-开关 (SX#2.3 U1#3.32), SPI-无线无线充 (SX#3.3 U1#4.3)
T-LED: SPI-遥控 (R2#2.2 U1#2.18), SPI-无线无线充 (R9#2.2 U1#4.20)